# EAGLE design SolarSimulatorPanel (EAGLE 9.0.1)
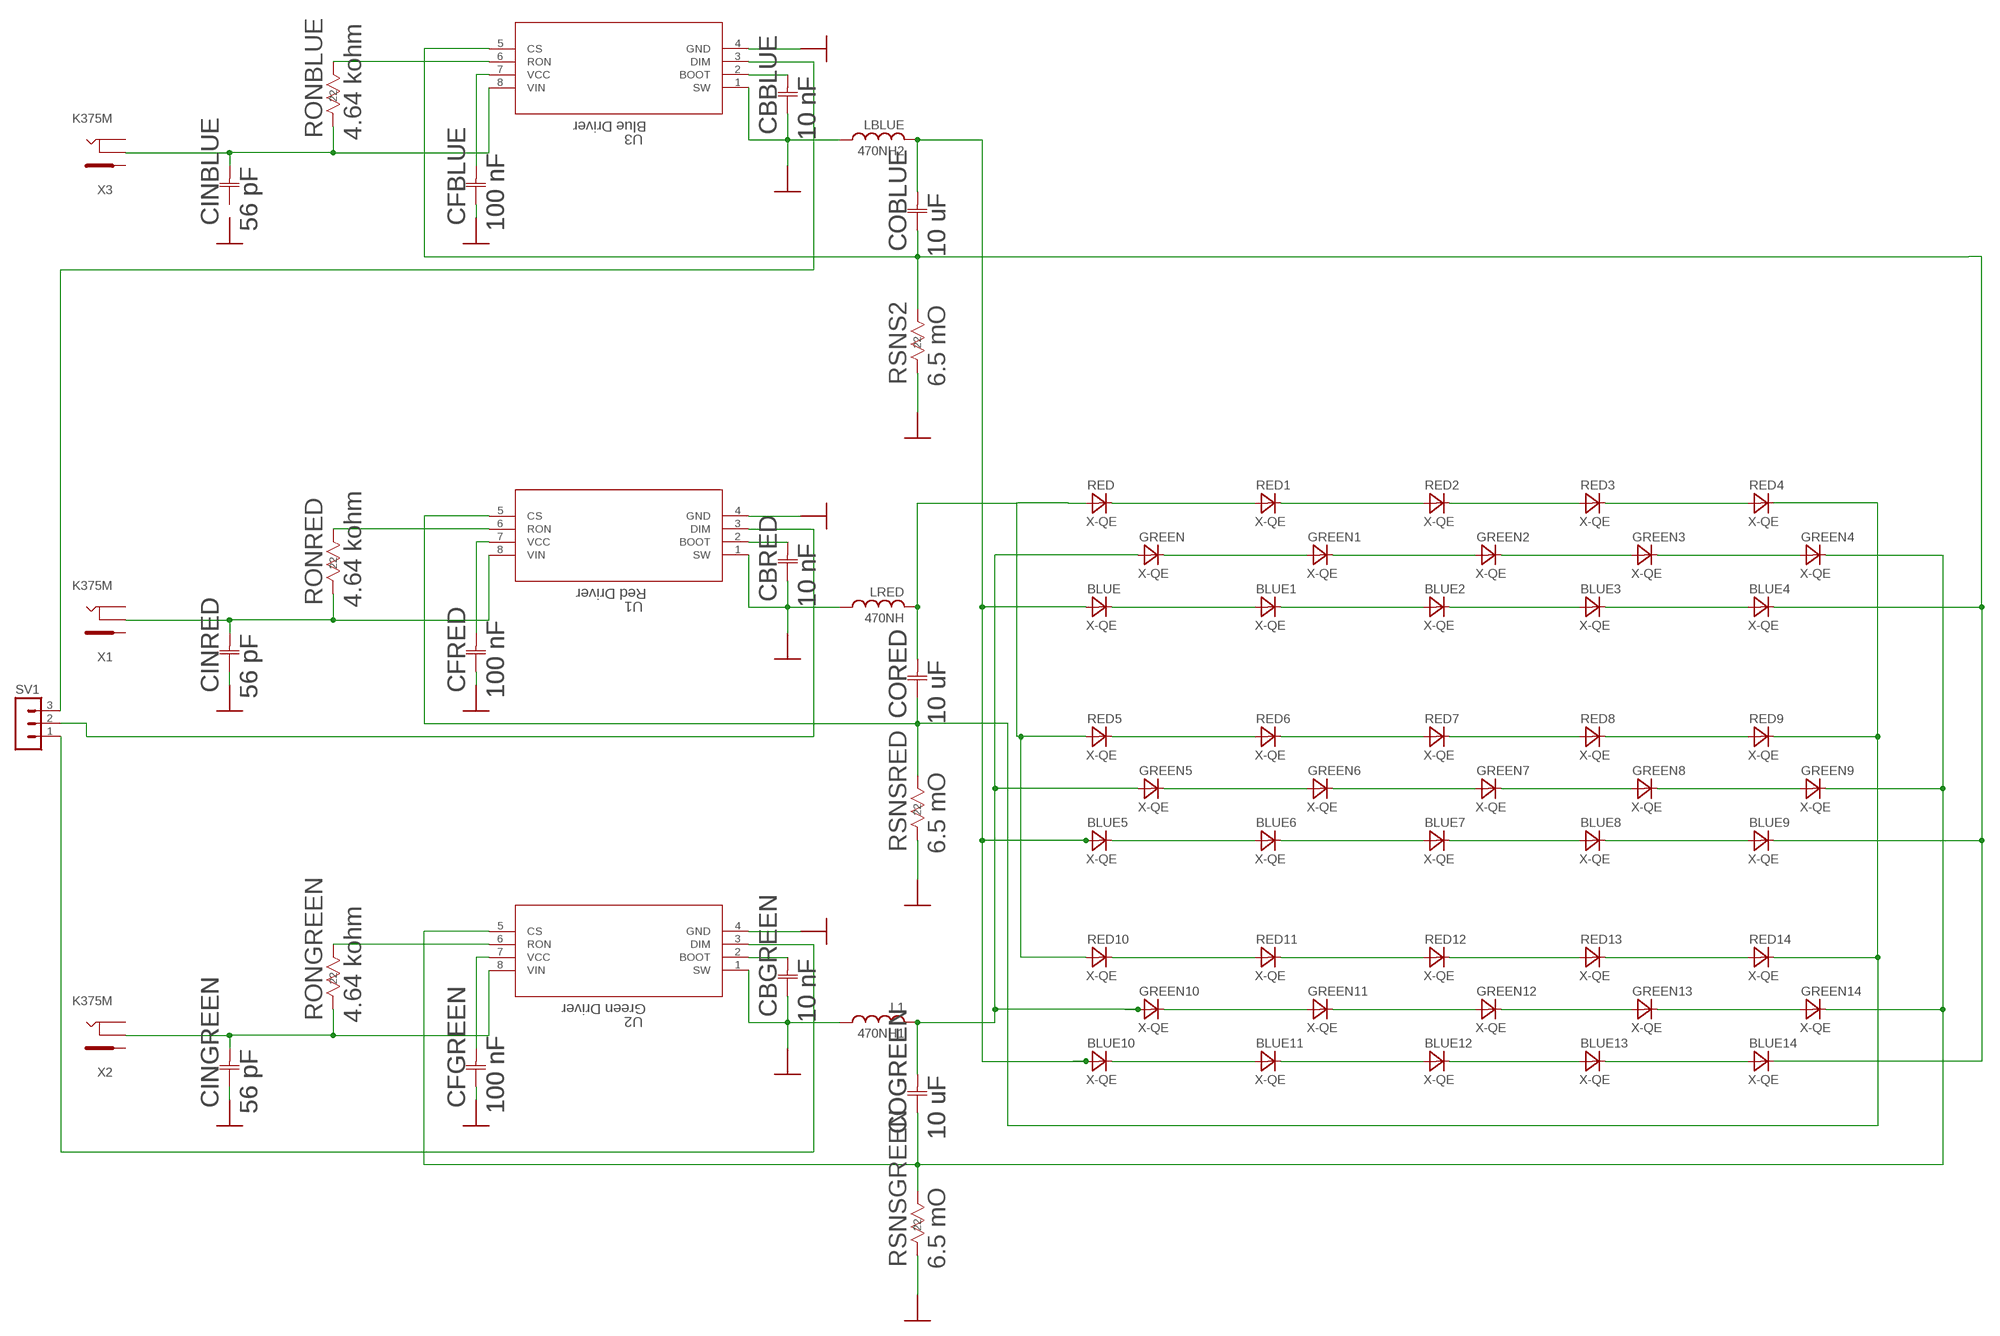
[diagram p0: schematic, sheet 1]

## Parts
470NH  LRED  LQM21INDUCTOR  [CAPC2012X135N]
470NH1  L1  LQM21INDUCTOR  [CAPC2012X135N]
470NH2  LBLUE  LQM21INDUCTOR  [CAPC2012X135N]
BLUE  X-QE  [X-QE]
BLUE1  X-QE  [X-QE]
BLUE2  X-QE  [X-QE]
BLUE3  X-QE  [X-QE]
BLUE4  X-QE  [X-QE]
BLUE5  X-QE  [X-QE]
BLUE6  X-QE  [X-QE]
BLUE7  X-QE  [X-QE]
BLUE8  X-QE  [X-QE]
BLUE9  X-QE  [X-QE]
BLUE10  X-QE  [X-QE]
BLUE11  X-QE  [X-QE]
BLUE12  X-QE  [X-QE]
BLUE13  X-QE  [X-QE]
BLUE14  X-QE  [X-QE]
CBBLUE  10 nF  CB  [C1206K]
CBGREEN  10 nF  CB  [C1206K]
CBRED  10 nF  CB  [C1206K]
CFBLUE  100 nF  CFCF  [C1206]
CFGREEN  100 nF  CFCF  [C1206]
CFRED  100 nF  CFCF  [C1206]
CINBLUE  56 pF  INPUTCAPACITOR  [CAP_0603G]
CINGREEN  56 pF  INPUTCAPACITOR  [CAP_0603G]
CINRED  56 pF  INPUTCAPACITOR  [CAP_0603G]
COBLUE  10 uF  OUTPUTCAPACITOR  [CAP_3225]
COGREEN  10 uF  OUTPUTCAPACITOR  [CAP_3225]
CORED  10 uF  OUTPUTCAPACITOR  [CAP_3225]
GREEN  X-QE  [X-QE]
GREEN1  X-QE  [X-QE]
GREEN2  X-QE  [X-QE]
GREEN3  X-QE  [X-QE]
GREEN4  X-QE  [X-QE]
GREEN5  X-QE  [X-QE]
GREEN6  X-QE  [X-QE]
GREEN7  X-QE  [X-QE]
GREEN8  X-QE  [X-QE]
GREEN9  X-QE  [X-QE]
GREEN10  X-QE  [X-QE]
GREEN11  X-QE  [X-QE]
GREEN12  X-QE  [X-QE]
GREEN13  X-QE  [X-QE]
GREEN14  X-QE  [X-QE]
RED  X-QE  [X-QE]
RED1  X-QE  [X-QE]
RED2  X-QE  [X-QE]
RED3  X-QE  [X-QE]
RED4  X-QE  [X-QE]
RED5  X-QE  [X-QE]
RED6  X-QE  [X-QE]
RED7  X-QE  [X-QE]
RED8  X-QE  [X-QE]
RED9  X-QE  [X-QE]
RED10  X-QE  [X-QE]
RED11  X-QE  [X-QE]
RED12  X-QE  [X-QE]
RED13  X-QE  [X-QE]
RED14  X-QE  [X-QE]
RONBLUE  4.64 kohm  RT0603BRD074K64L  [RC0603N]
RONGREEN  4.64 kohm  RT0603BRD074K64L  [RC0603N]
RONRED  4.64 kohm  RT0603BRD074K64L  [RC0603N]
RSNS2  6.5 mO  RSNS  [R2512]
RSNSGREEN  6.5 mO  RSNS  [R2512]
RSNSRED  6.5 mO  RSNS  [R2512]
SV1  MA03-1  [MA03-1]
U1  Red Driver  LM3404HVMA  [M08A]
U2  Green Driver  LM3404HVMA  [M08A]
U3  Blue Driver  LM3404HVMA  [M08A]
X1  K375M  [K375M]
X2  K375M  [K375M]
X3  K375M  [K375M]

## Nets
N$1: CINRED.2 RONRED.2 U1.8(VIN) X1.3
N$2: 470NH.1 CBRED.1 U1.1(SW)
N$3: 470NH.2 CORED.2 RED5.INPUT(A) RED10.INPUT(A) RED.INPUT(A)
N$4: CFRED.2 U1.7(VCC)
N$5: RED5.OUTPUT(C) RED6.INPUT(A)
N$6: RONRED.1 U1.6(RON)
N$7: RED6.OUTPUT(C) RED7.INPUT(A)
N$8: RED7.OUTPUT(C) RED8.INPUT(A)
N$9: RED8.OUTPUT(C) RED9.INPUT(A)
N$10: RED10.OUTPUT(C) RED11.INPUT(A)
N$11: RED11.OUTPUT(C) RED12.INPUT(A)
N$12: RED12.OUTPUT(C) RED13.INPUT(A)
N$13: RED13.OUTPUT(C) RED14.INPUT(A)
N$14: RED1.INPUT(A) RED.OUTPUT(C)
N$15: RED1.OUTPUT(C) RED2.INPUT(A)
N$16: RED2.OUTPUT(C) RED3.INPUT(A)
N$17: RED3.OUTPUT(C) RED4.INPUT(A)
N$18: 470NH2.1 CBBLUE.1 U3.1(SW)
N$19: RSNSRED.2
N$20: U1.4(GND)
N$21: SV1.2 U1.3(DIM)
N$22: CBRED.2 U1.2(BOOT)
N$23: CFRED.1
N$24: 470NH1.1 CBGREEN.1 U2.1(SW)
N$26: RONGREEN.1 U2.6(RON)
N$27: CINGREEN.2 RONGREEN.2 U2.8(VIN) X2.3
N$28: COGREEN.1 GREEN4.OUTPUT(C) GREEN9.OUTPUT(C) GREEN14.OUTPUT(C) RSNSGREEN.1 U2.5(CS)
N$29: RSNSGREEN.2
N$30: U2.4(GND)
N$31: SV1.1 U2.3(DIM)
N$32: CBGREEN.2 U2.2(BOOT)
N$33: CFGREEN.2 U2.7(VCC)
N$34: CFGREEN.1
N$35: GREEN1.INPUT(A) GREEN.OUTPUT(C)
N$36: GREEN1.OUTPUT(C) GREEN2.INPUT(A)
N$37: GREEN2.OUTPUT(C) GREEN3.INPUT(A)
N$38: GREEN3.OUTPUT(C) GREEN4.INPUT(A)
N$39: GREEN5.OUTPUT(C) GREEN6.INPUT(A)
N$40: GREEN6.OUTPUT(C) GREEN7.INPUT(A)
N$41: GREEN7.OUTPUT(C) GREEN8.INPUT(A)
N$42: GREEN8.OUTPUT(C) GREEN9.INPUT(A)
N$43: GREEN10.OUTPUT(C) GREEN11.INPUT(A)
N$44: GREEN11.OUTPUT(C) GREEN12.INPUT(A)
N$45: GREEN12.OUTPUT(C) GREEN13.INPUT(A)
N$46: GREEN13.OUTPUT(C) GREEN14.INPUT(A)
N$48: BLUE1.INPUT(A) BLUE.OUTPUT(C)
N$49: RONBLUE.1 U3.6(RON)
N$50: CINBLUE.2 RONBLUE.2 U3.8(VIN) X3.3
N$52: RSNS2.2
N$53: U3.4(GND)
N$54: SV1.3 U3.3(DIM)
N$55: CBBLUE.2 U3.2(BOOT)
N$56: CFBLUE.2 U3.7(VCC)
N$57: CFBLUE.1
N$59: BLUE1.OUTPUT(C) BLUE2.INPUT(A)
N$60: BLUE2.OUTPUT(C) BLUE3.INPUT(A)
N$61: BLUE3.OUTPUT(C) BLUE4.INPUT(A)
N$62: BLUE5.OUTPUT(C) BLUE6.INPUT(A)
N$63: BLUE6.OUTPUT(C) BLUE7.INPUT(A)
N$64: BLUE7.OUTPUT(C) BLUE8.INPUT(A)
N$65: BLUE8.OUTPUT(C) BLUE9.INPUT(A)
N$66: BLUE10.OUTPUT(C) BLUE11.INPUT(A)
N$67: BLUE11.OUTPUT(C) BLUE12.INPUT(A)
N$68: BLUE12.OUTPUT(C) BLUE13.INPUT(A)
N$69: BLUE13.OUTPUT(C) BLUE14.INPUT(A)
N$70: BLUE4.OUTPUT(C) BLUE9.OUTPUT(C) BLUE14.OUTPUT(C) COBLUE.1 RSNS2.1 U3.5(CS)
N$77: GREEN5.INPUT(A)
N$78: 470NH2.2 BLUE5.INPUT(A) BLUE10.INPUT(A) BLUE.INPUT(A) COBLUE.2
N$79: CORED.1 RED4.OUTPUT(C) RED9.OUTPUT(C) RED14.OUTPUT(C) RSNSRED.1 U1.5(CS)
N$80: 470NH1.2 COGREEN.2 GREEN10.INPUT(A) GREEN.INPUT(A)
N$82: CINRED.1
N$83: CINGREEN.1
Unconnected: CINBLUE.1 X1.1 X1.2 X2.1 X2.2 X3.1 X3.2

## Library data of the parts
470NH 470NH1 470NH2 = solarsim:LQM21INDUCTOR
BLUE BLUE1-BLUE14 GREEN GREEN1-GREEN14 RED RED1-RED14 = solarsim:X-QE
CBBLUE CBGREEN CBRED = solarsim:CB
CFBLUE CFGREEN CFRED = solarsim:CF
CINBLUE CINGREEN CINRED = solarsim:INPUTCAPACITOR; MANUFACTURER_PART_NUMBER: 06031A560GAT2A; VENDOR: AVX Corporation
COBLUE COGREEN CORED = solarsim:OUTPUTCAPACITOR; MANUFACTURER_PART_NUMBER: C3225X7R1H106M250AC; VENDOR: TDK
RONBLUE RONGREEN RONRED = solarsim:RT0603BRD074K64L; MANUFACTURER_PART_NUMBER: RT0603BRD074K64L; VENDOR: Yageo
RSNS2 RSNSGREEN RSNSRED = solarsim:RSNS
SV1 = con-lstb:MA03-1: PIN HEADER; OC_FARNELL: unknown; OC_NEWARK: unknown
U1-U3 = solarsim:LM3404HVMA; MANUFACTURER_PART_NUMBER: lm3404hvma; VENDOR: Texas Instruments
X1-X3 = con-shallin:K375M: K375M - DC POWER JACK 2.5mm/CENTRAL PIN Source: Data sheet <http://www.shallin.com/productview.aspx?itemnumber=K375M>

## Board
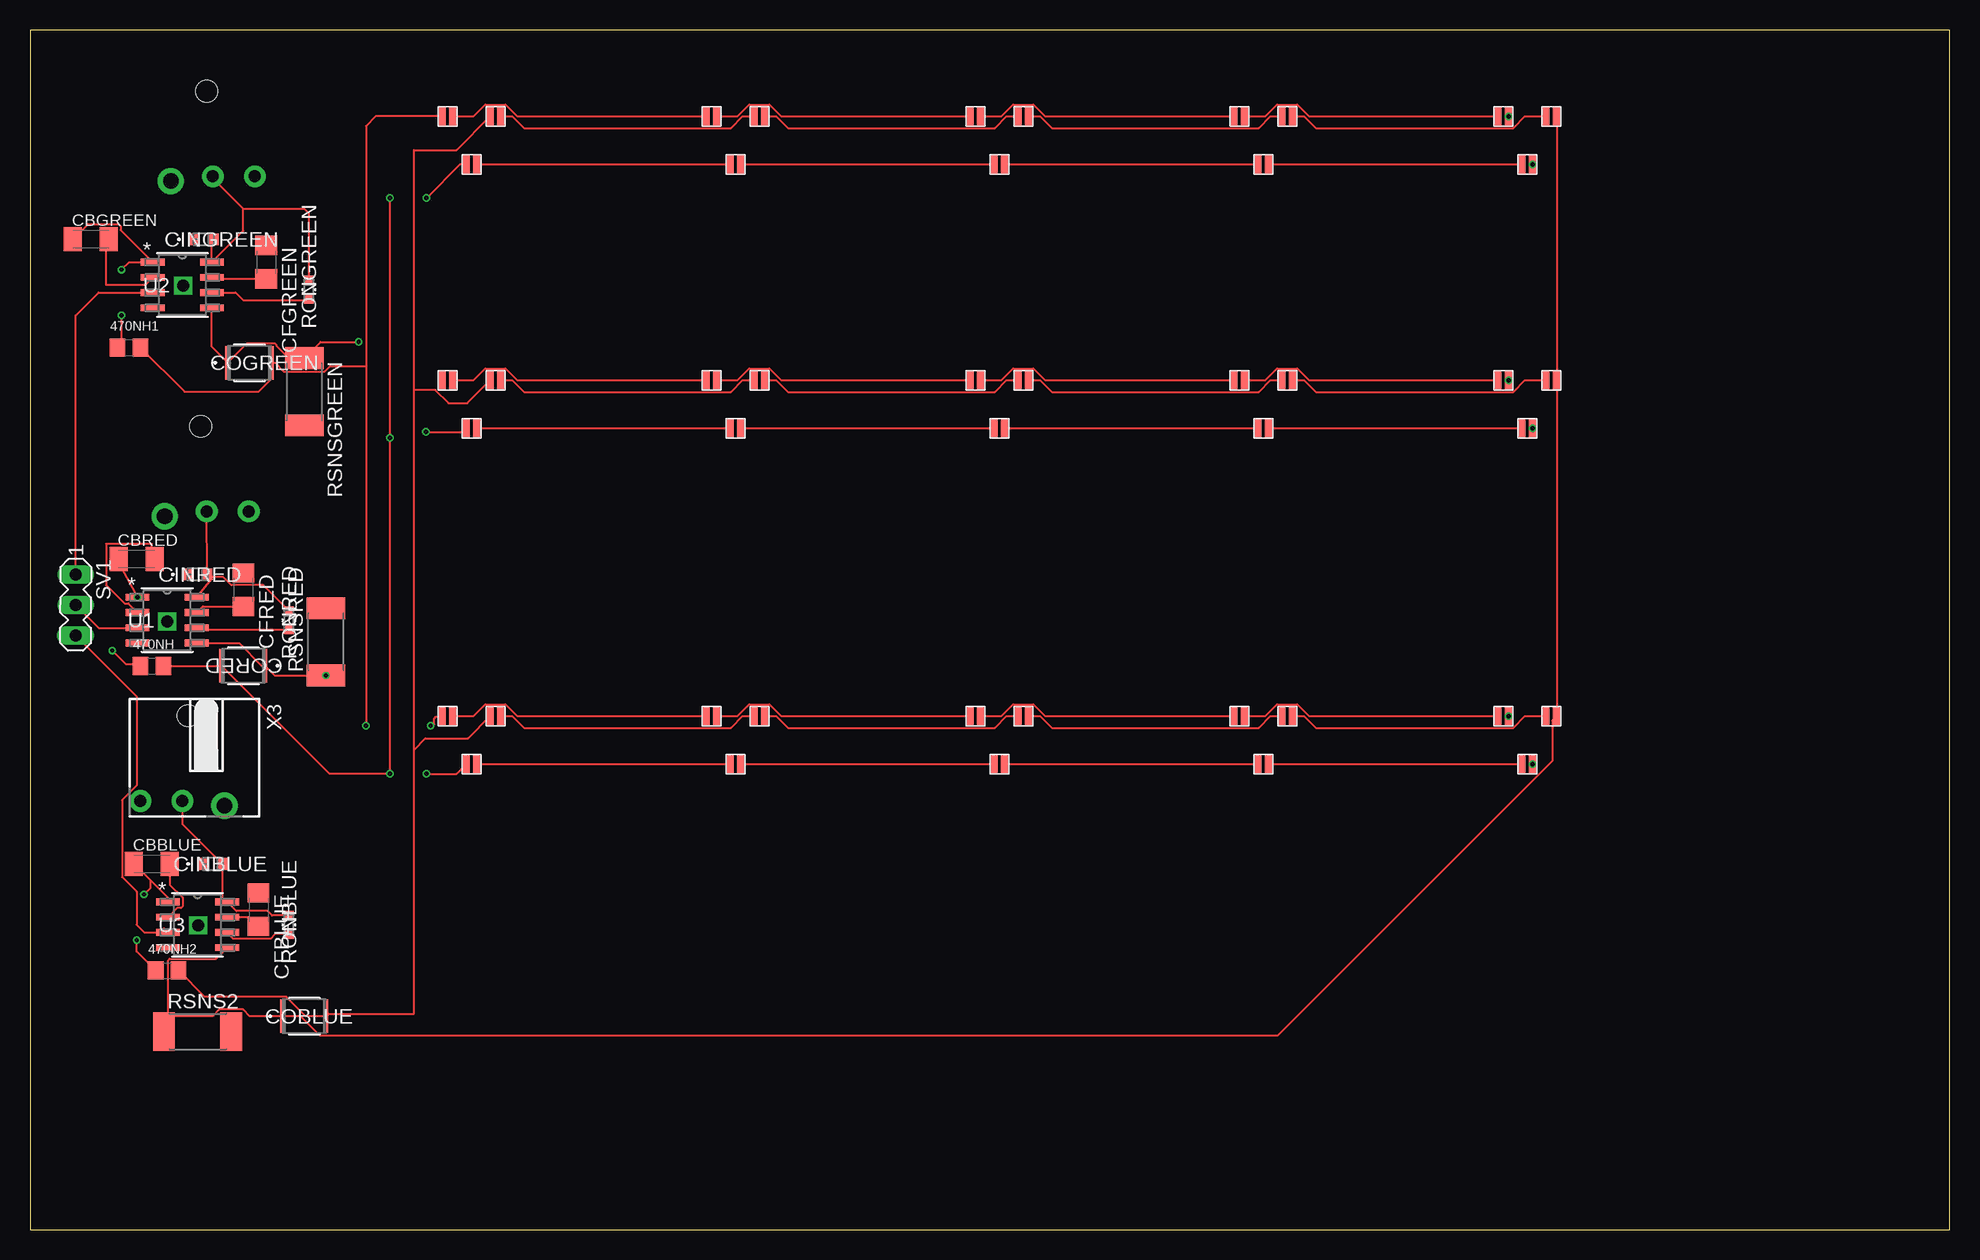
[diagram p1: board, top side]
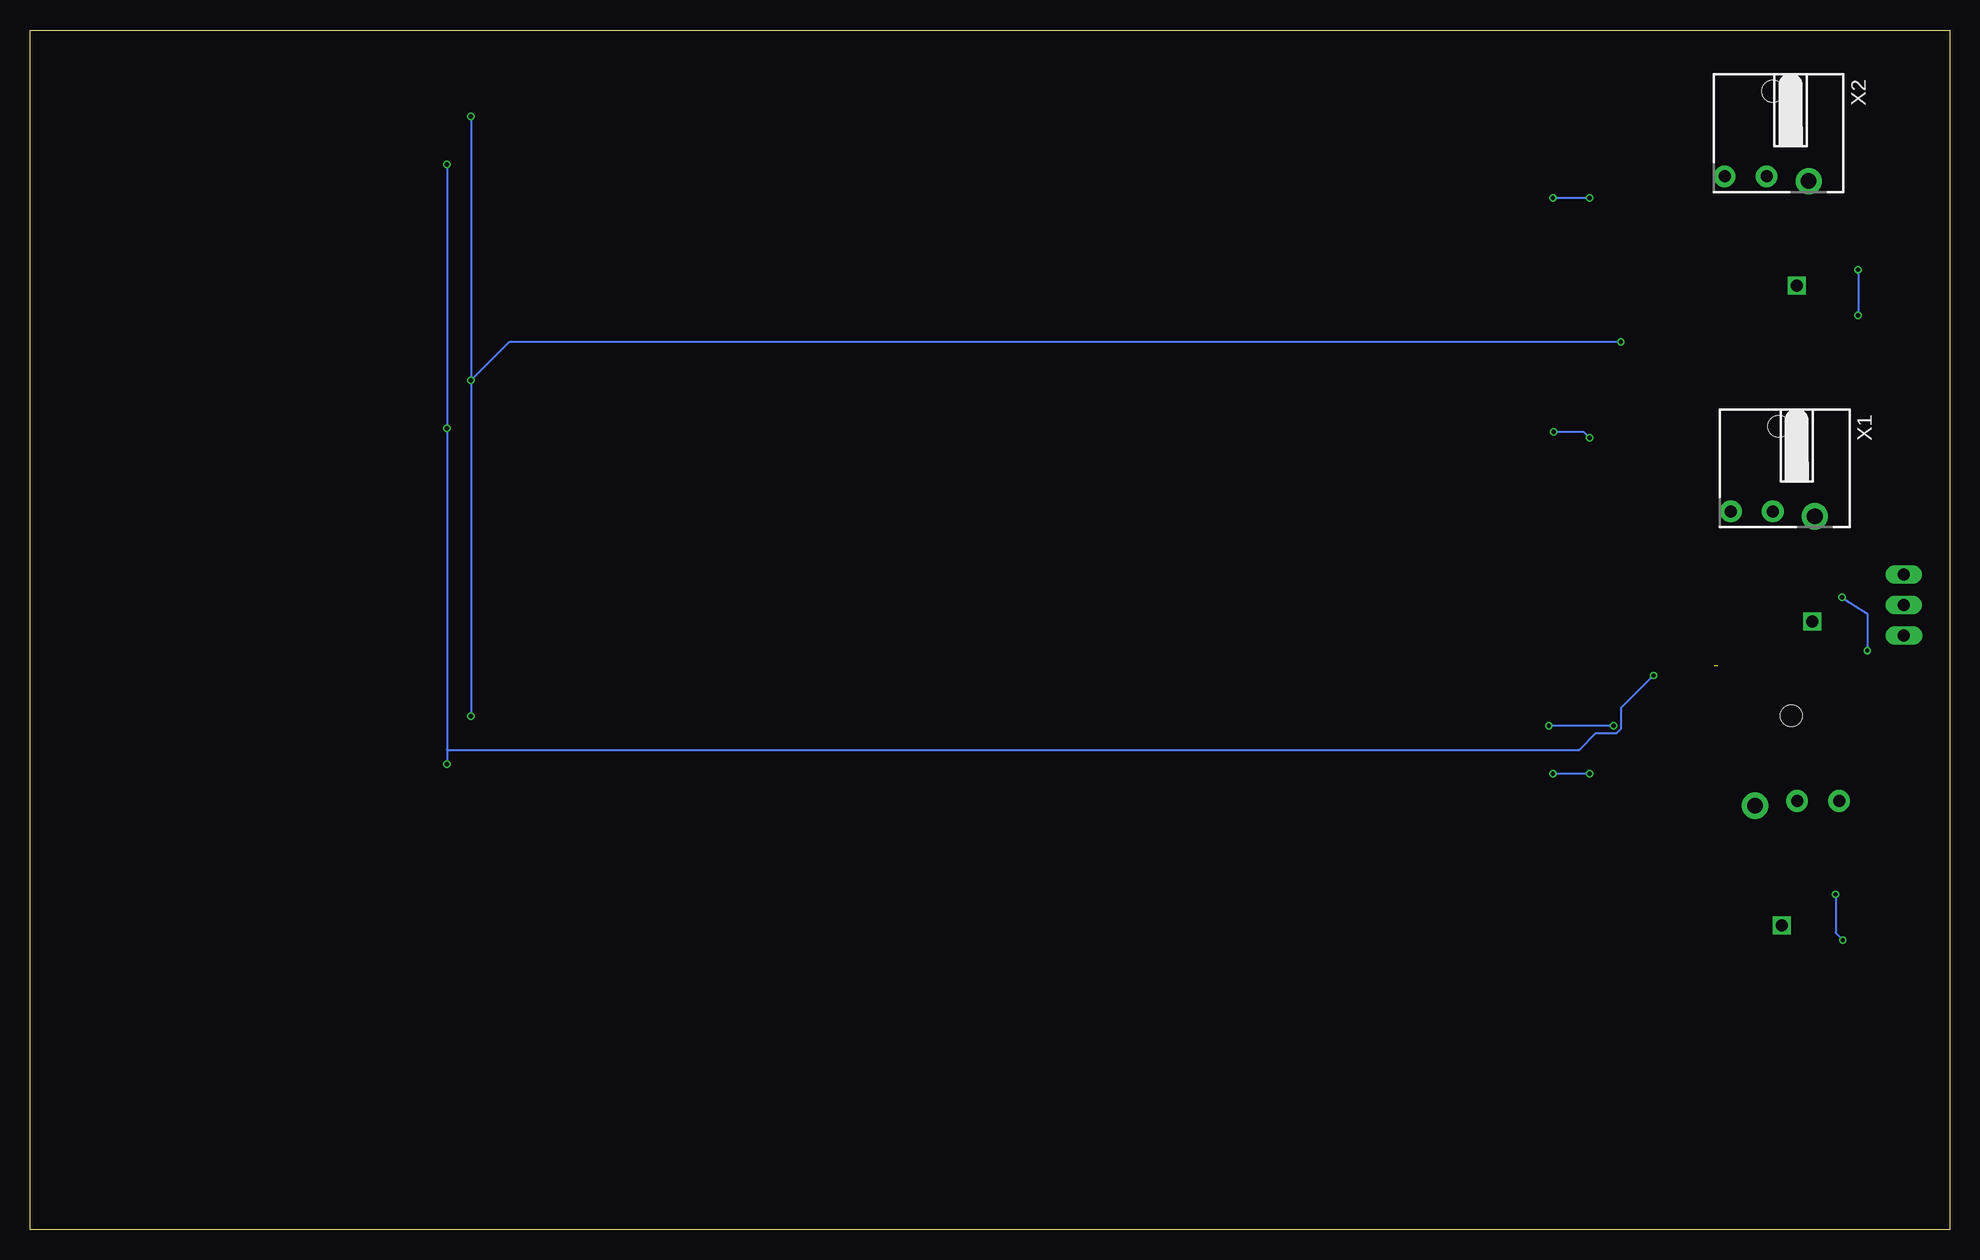
[diagram p2: board, bottom side, seen from below]

Size 160 x 100 mm. Coordinates in mm from the lower left corner, seen from the top.
Outline: 0,0 160,0 160,100 0,100 0,0
Copper layers (1*16): Top 0.035559375mm / dielectric 1.6mm / Bottom 0.035559375mm
Design rules "oshpark-2layer": minimum track width 6mil, minimum drill 10mil, track to track 6mil, track to pad 6mil, pad to pad 6mil, via to via 6mil, smd to smd 6mil, copper to edge 15mil, drill to drill 6mil, minimum pad ring 5mil, minimum via ring 5mil, stop-mask expansion 2.5mil, vias tented up to drill 0mil, thermal gap 10mil

### Footprints (pad centres in the part's own frame; a part is rotated, then mirrored left to right if it is on the bottom)
CAPC2012X135N = smd 1.3 x 1.5: 1 -0.95,0; 2 0.95,0
X-QE = smd 0.6 x 1.5: INPUT 0.35,0.8; OUTPUT 1.25,0.8
C1206K = smd 1.5 x 2: 1 -1.5,0; 2 1.5,0
C1206 = smd 1.6 x 1.8: 1 -1.4,0; 2 1.4,0
CAP_0603G = smd 0.864 x 0.965: 1 -0.8,0; 2 0.8,0
CAP_3225 = smd 0.406 x 2.794: 1 -1.803,0; 2 1.803,0
RC0603N = smd 0.762 x 0.813: 1 -0.775,0; 2 0.775,0
R2512 = smd 1.8 x 3.2: 1 -2.8,0; 2 2.8,0
MA03-1 = drill 1.016 long: 1 -2.54,0; 2 0,0; 3 2.54,0
M08A = smd 1.981 x 0.559: 1 -2.464,1.905; 2 -2.464,0.635; 3 -2.464,-0.635; 4 -2.464,-1.905; 5 2.464,-1.905; 6 2.464,-0.635; 7 2.464,0.635; 8 2.464,1.905
K375M = drill 1.3 pad 2.184: 1 -3.5,1.5 | drill 1 pad 1.8: 2 3.5,1.1; 3 0,1.1 | hole 1.8: -0.5,-6

### Placement (x,y rotation side)
470NH  10.16,46.99 0 top
470NH1  8.26,73.53 0 top
470NH2  11.43,21.59 0 top
BLUE  38,70 0 top
BLUE1  60,70 0 top
BLUE2  82,70 0 top
BLUE3  104,70 0 top
BLUE4  126,70 0 top
BLUE5  38,92 0 top
BLUE6  60,92 0 top
BLUE7  82,92 0 top
BLUE8  104,92 0 top
BLUE9  126,92 0 top
BLUE10  38,42 0 top
BLUE11  60,42 0 top
BLUE12  82,42 0 top
BLUE13  104,42 0 top
BLUE14  126,42 0 top
CBBLUE  10.16,30.48 0 top
CBGREEN  5.08,82.55 0 top
CBRED  8.89,55.88 0 top
CFBLUE  19.05,26.67 270 top
CFGREEN  19.68,80.64 270 top
CFRED  17.78,53.34 270 top
CINBLUE  15.24,30.48 0 top
CINGREEN  14.48,82.55 0 top
CINRED  13.97,54.61 0 top
COBLUE  22.86,17.78 0 top
COGREEN  18.29,72.26 0 top
CORED  17.78,46.99 180 top
GREEN  34,92 0 top
GREEN1  56,92 0 top
GREEN2  78,92 0 top
GREEN3  100,92 0 top
GREEN4  122,92 0 top
GREEN5  34,70 0 top
GREEN6  56,70 0 top
GREEN7  78,70 0 top
GREEN8  100,70 0 top
GREEN9  122,70 0 top
GREEN10  34,42 0 top
GREEN11  56,42 0 top
GREEN12  78,42 0 top
GREEN13  100,42 0 top
GREEN14  122,42 0 top
RED  36,38 0 top
RED1  58,38 0 top
RED2  80,38 0 top
RED3  102,38 0 top
RED4  124,38 0 top
RED5  36,66 0 top
RED6  58,66 0 top
RED7  80,66 0 top
RED8  102,66 0 top
RED9  124,66 0 top
RED10  36,88 0 top
RED11  58,88 0 top
RED12  80,88 0 top
RED13  102,88 0 top
RED14  124,88 0 top
RONBLUE  21.59,25.4 90 top
RONGREEN  23.24,78.36 90 top
RONRED  21.59,50.8 90 top
RSNS2  13.97,16.51 0 top
RSNSGREEN  22.86,69.85 270 top
RSNSRED  24.67,48.99 90 top
SV1  3.81,52.07 269.8 top
U1  11.43,50.8 0 top
U2  12.7,78.74 0 top
U3  13.97,25.4 0 top
X1  14.73,60.96 180 bottom
X2  15.24,88.9 180 bottom
X3  12.7,36.83 180 top

### Tracks (layer width: path | path; a pad name or v marks a point on that pad's centre or on a via)
N$1
  Top 0.152: X1.3 CINRED.2 15.01,54.38 | U1.8 15.16,54.22 15.01,54.38 | RONRED.2 19.45,53.71 16.79,53.71 16.12,54.38 15.01,54.38
N$2  (via drill 0.35)
  Top 0.152: CBRED.1 7.39,55.55 U1.1 | 8.89,47.31 9.05,47.15 | 9.05,47.15 470NH.1 | v6.86,48.26 7.97,47.15 9.05,47.15
  Bottom 0.152: U1.1 6.86,51.36 v6.86,48.26
  other vias: 8.97,52.7
N$3  (via drill 0.35)
  Top 0.152: 470NH.2 CORED.2 24.97,38 v30,38 v30,66 v30,86 | RED5.INPUT 36.05,66.5 v33,66.5 | RED.INPUT 35.55,38 v33.05,38 | v33.05,86 35.85,88.8 RED10.INPUT
  Bottom 0.152: v30,38 v33.05,38 | v30,66 30.5,66.5 v33,66.5 | v30,86 v33.05,86
N$4
  Top 0.152: U1.7 14.4,51.94 CFRED.2
N$5
  Top 0.152: RED5.OUTPUT RED6.INPUT
N$6
  Top 0.152: U1.6 14.03,50.02 RONRED.1
N$7
  Top 0.152: RED6.OUTPUT RED7.INPUT
N$8
  Top 0.152: RED7.OUTPUT RED8.INPUT
N$9
  Top 0.152: RED8.OUTPUT RED9.INPUT
N$10
  Top 0.152: RED10.OUTPUT RED11.INPUT
N$11
  Top 0.152: RED11.OUTPUT RED12.INPUT
N$12
  Top 0.152: RED12.OUTPUT RED13.INPUT
N$13
  Top 0.152: RED13.OUTPUT RED14.INPUT
N$14
  Top 0.152: RED.OUTPUT RED1.INPUT
N$15
  Top 0.152: RED1.OUTPUT RED2.INPUT
N$16
  Top 0.152: RED2.OUTPUT RED3.INPUT
N$17
  Top 0.152: RED3.OUTPUT RED4.INPUT
N$18  (via drill 0.35)
  Top 0.152: CBBLUE.1 10.04,29.09 | 10.04,29.09 11.51,27.63 U3.1 | 470NH2.1 8.89,23.18 v8.89,24.13 | v9.5,27.94 10.04,28.49 10.04,29.09
  Bottom 0.152: v8.89,24.13 9.5,24.74 v9.5,27.94
N$21
  Top 0.152: SV1.2 5.71,50.16 U1.3
N$22
  Top 0.152: CBRED.2 10.16,56.11 10.16,57.15 6.35,57.15 6.35,53.73 7.88,52.2 8.2,52.2 U1.2
N$24  (via drill 0.35)
  Top 0.152: CBGREEN.1 4.85,83.82 7.38,83.82 7.56,83.64 7.56,83.32 U2.1 8.26,80.64 v7.62,80.01 | v7.62,76.2 7.62,73.85 470NH1.1
  Bottom 0.152: v7.62,80.01 v7.62,76.2
N$25
  Top 0.152: 34.21,70.66 34.21,70.43
N$26
  Top 0.152: U2.6 17.14,78.11 17.78,77.47 23.13,77.47 RONGREEN.1
N$27
  Top 0.152: CINGREEN.2 15.16,82.44 U2.8 17.78,83.26 17.78,85.09 | 17.78,85.09 22.86,85.09 23.24,84.71 RONGREEN.2 | 17.78,85.09 15.24,87.63 X2.3
N$28  (via drill 0.35)
  Top 0.152: U2.5 15.16,73.58 COGREEN.1 18.11,73.89 20.39,73.89 20.52,73.75 20.52,73.69 21.58,72.63 22.8,72.63 | 21.89,72.39 22.8,72.63 | 22.8,72.63 RSNSGREEN.1 24.21,74 v27.39,74 | GREEN14.OUTPUT 123.25,42.75
  Bottom 0.152: GREEN4.OUTPUT GREEN9.OUTPUT | GREEN9.OUTPUT GREEN14.OUTPUT | v27.39,74 120.05,74 GREEN9.OUTPUT
  other vias: 123.25,92.8 123.25,70.8 123.25,42.8
N$31
  Top 0.152: SV1.1 3.82,76.19 3.81,76.2 5.71,78.11 U2.3
N$32
  Top 0.152: 9.76,79.38 U2.2 9.6,78.74 6.35,78.74 6.35,82.32 CBGREEN.2
N$33
  Top 0.152: CFGREEN.2 15.29,79.25 U2.7
N$35
  Top 0.152: GREEN.OUTPUT 36.98,92.8 37.95,93.78 39.65,93.78 40.62,92.8 GREEN1.INPUT
N$36
  Top 0.152: GREEN1.OUTPUT 58.98,92.8 59.95,93.78 61.65,93.78 62.62,92.8 GREEN2.INPUT
N$37
  Top 0.152: GREEN2.OUTPUT 80.98,92.8 81.95,93.78 83.64,93.78 84.62,92.8 GREEN3.INPUT
N$38
  Top 0.152: GREEN3.OUTPUT 102.98,92.8 103.95,93.78 105.64,93.78 106.62,92.8 GREEN4.INPUT
N$39
  Top 0.152: GREEN5.OUTPUT 36.98,70.8 37.95,71.78 39.65,71.78 40.62,70.8 GREEN6.INPUT
N$40
  Top 0.152: GREEN6.OUTPUT 58.98,70.8 59.95,71.78 61.65,71.78 62.62,70.8 GREEN7.INPUT
N$41
  Top 0.152: GREEN7.OUTPUT 80.98,70.8 81.95,71.78 83.64,71.78 84.62,70.8 GREEN8.INPUT
N$42
  Top 0.152: GREEN8.OUTPUT 102.98,70.8 103.95,71.78 105.64,71.78 106.62,70.8 GREEN9.INPUT
N$43
  Top 0.152: GREEN10.OUTPUT 36.98,42.8 37.95,43.78 39.65,43.78 40.62,42.8 GREEN11.INPUT
N$44
  Top 0.152: GREEN11.OUTPUT 58.98,42.8 59.95,43.78 61.65,43.78 62.62,42.8 GREEN12.INPUT
N$45
  Top 0.152: GREEN12.OUTPUT 80.98,42.8 81.95,43.78 83.64,43.78 84.62,42.8 GREEN13.INPUT
N$46
  Top 0.152: GREEN13.OUTPUT 102.98,42.8 103.95,43.78 105.64,43.78 106.62,42.8 GREEN14.INPUT
N$48
  Top 0.152: BLUE.OUTPUT 40.19,70.8 41.17,69.82 58.43,69.82 59.41,70.8 BLUE1.INPUT
N$49
  Top 0.152: RONBLUE.1 20.43,24.62 20.05,24.24 16.96,24.24 U3.6
N$50
  Top 0.152: X3.3 12.7,33.82 CINBLUE.2 16.04,27.7 U3.8 17.2,26.54 19.8,26.54 20.17,26.18 RONBLUE.2
N$51  (via drill 1)
  other vias: 11.45,50.7
N$54
  Top 0.152: 11.15,25.12 U3.3 9.53,24.77 8.89,25.4 8.89,28.18 7.68,29.39 7.68,35.81 8.89,37.02 8.89,44.44 SV1.3
N$55
  Top 0.152: CBBLUE.2 11.66,28.74 12.72,27.68 12.72,26.93 12.59,26.8 12.27,26.8 U3.2
N$56
  Top 0.152: CFBLUE.2 18.29,26.04 U3.7
N$59
  Top 0.152: BLUE1.OUTPUT 62.19,70.8 63.17,69.82 80.43,69.82 81.41,70.8 BLUE2.INPUT
N$60
  Top 0.152: BLUE2.OUTPUT 84.19,70.8 85.17,69.82 102.43,69.82 103.41,70.8 BLUE3.INPUT
N$61
  Top 0.152: BLUE3.OUTPUT 106.19,70.8 107.17,69.82 123.64,69.82 124.62,70.8 BLUE4.INPUT
N$62
  Top 0.152: BLUE5.OUTPUT 40.19,92.8 41.17,91.82 58.43,91.82 59.41,92.8 BLUE6.INPUT
N$63
  Top 0.152: BLUE6.OUTPUT 62.19,92.8 63.17,91.82 80.43,91.82 81.41,92.8 BLUE7.INPUT
N$64
  Top 0.152: BLUE7.OUTPUT 84.19,92.8 85.17,91.82 102.43,91.82 103.41,92.8 BLUE8.INPUT
N$65
  Top 0.152: BLUE8.OUTPUT 106.19,92.8 107.17,91.82 123.64,91.82 124.62,92.8 BLUE9.INPUT
N$66
  Top 0.152: BLUE10.OUTPUT 40.19,42.8 41.17,41.82 58.43,41.82 59.41,42.8 BLUE11.INPUT
N$67
  Top 0.152: BLUE11.OUTPUT 62.19,42.8 63.17,41.82 80.43,41.82 81.41,42.8 BLUE12.INPUT
N$68
  Top 0.152: BLUE12.OUTPUT 84.19,42.8 85.17,41.82 102.43,41.82 103.41,42.8 BLUE13.INPUT
N$69
  Top 0.152: BLUE13.OUTPUT 106.19,42.8 107.17,41.82 123.64,41.82 124.62,42.8 BLUE14.INPUT
N$70
  Top 0.152: RSNS2.1 11.5,16.84 11.5,17.78 | U3.5 15.51,22.57 11.63,22.57 11.5,22.43 11.5,17.78 | 11.5,17.78 15.22,17.78 15.78,18.34 17.77,18.34 18.32,17.78 COBLUE.1 22.55,17.78 24.18,16.15 103.98,16.15 126.88,39.05 126.88,42.43 BLUE14.OUTPUT BLUE4.OUTPUT BLUE9.OUTPUT
N$71  (via drill 1)
  other vias: 14,25.35
N$72  (via drill 1)
  other vias: 12.75,78.7
N$78
  Top 0.152: 470NH2.2 14.56,19.41 21.35,19.41 22.98,17.78 COBLUE.2 24.88,18 32,18 32,40 | 32,40 32,70 | 32,70 32,90 35.55,90 BLUE5.INPUT | 32,70 33.78,70 34.89,68.89 36.44,68.89 BLUE.INPUT | 32,40 32.95,40.95 36.5,40.95 BLUE10.INPUT
N$79  (via drill 0.35)  (1 unrouted)
  Top 0.152: U1.5 17.42,48.9 19.32,46.99 | CORED.1 20.38,46.19 RSNSRED.1
  Bottom 0.152: RED14.OUTPUT RED9.OUTPUT 125.25,40 | 125.25,40 RED4.OUTPUT | 125.25,40 30.86,40 29.46,41.39 27.75,41.39 27.39,41.75 27.39,43.47 RSNSRED.1
  other vias: 125.25,88.8 125.25,66.8 125.25,38.8 24.67,46.19
N$80  (via drill 0.35)
  Top 0.152: 470NH1.2 12.89,69.85 19.05,69.85 20.09,70.89 COGREEN.2 20.42,72.26 21.16,71.52 24.55,71.52 25.03,72 28,72 | 28,72 v28,42 | 28,72 28,92 28.8,92.8 GREEN.INPUT | v33.39,42 33.55,42 33.7,42.15 33.7,42.58 33.87,42.76 34.3,42.76 GREEN10.INPUT
  Bottom 0.152: v28,42 v33.39,42